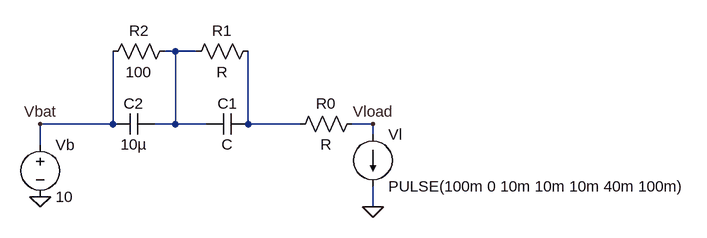
[diagram p0: schematic Draft1.asc]
Draft1.asc, the LTspice schematic file:
Version 4
SHEET 1 1024 680
WIRE 208 32 192 32
WIRE 240 32 208 32
WIRE 112 144 112 32
WIRE 112 144 0 144
WIRE 208 144 208 32
WIRE 208 144 176 144
WIRE 256 144 208 144
WIRE 320 144 320 32
WIRE 400 144 320 144
WIRE 512 144 480 144
WIRE 512 160 512 144
WIRE 0 176 0 144
WIRE 512 272 512 240
FLAG 0 256 0
FLAG 0 144 Vbat
FLAG 512 272 0
FLAG 512 144 Vload
SYMBOL voltage 0 160 R0
WINDOW 123 0 0 Left 0
WINDOW 39 0 0 Left 0
SYMATTR InstName Vb
SYMATTR Value 10
SYMBOL cap 320 128 R90
WINDOW 0 0 32 VBottom 2
WINDOW 3 32 32 VTop 2
SYMATTR InstName C1
SYMBOL cap 176 128 R90
WINDOW 0 0 32 VBottom 2
WINDOW 3 32 32 VTop 2
SYMATTR InstName C2
SYMATTR Value 10µ
SYMBOL res 496 128 R90
WINDOW 0 0 56 VBottom 2
WINDOW 3 32 56 VTop 2
SYMATTR InstName R0
SYMBOL res 336 16 R90
WINDOW 0 0 56 VBottom 2
WINDOW 3 32 56 VTop 2
SYMATTR InstName R1
SYMBOL res 208 16 R90
WINDOW 0 0 56 VBottom 2
WINDOW 3 32 56 VTop 2
SYMATTR InstName R2
SYMATTR Value 100
SYMBOL current 512 160 R0
WINDOW 123 0 0 Left 0
WINDOW 39 0 0 Left 0
SYMATTR InstName Vl
SYMATTR Value PULSE(100m 0 10m 10m 10m 40m 100m)

The netlist it stands for:
* Draft1.asc
Vb Vbat 0 10
C1 N002 N001 C
C2 N001 Vbat 10µ
R0 Vload N002 R
R1 N002 N001 R
R2 N001 Vbat 100
I§Vl Vload 0 PULSE(100m 0 10m 10m 10m 40m 100m)
.backanno
.end